# EAGLE design led (EAGLE 5.11)
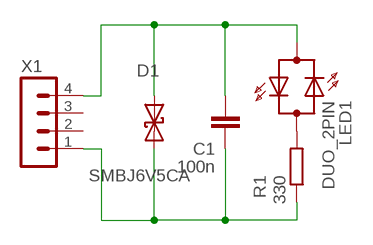
[diagram p0: schematic, sheet 1]

## Parts
C1  100n  C-SMD0805  [0805]
D1  SMBJ6V5CA  TRANZIL_BIDIRSMB_FW  [SMB_FW]
LED1  DUO_2PIN  [DUO_2PIN]
R1  330  R0805  [R0805]
X1  MA04-1  [MA04-1]

## Nets
N$1: C1.1 D1.A LED1.AK1(A) X1.4
N$2: C1.2 D1.C R1.1 X1.1
N$13: LED1.AK2(C) R1.2
Unconnected: X1.2 X1.3

## Library data of the parts
C1 = keramicke kondenzatory SMD:C-SMD: Kondenzátory keramické SMD 50 V
D1 = diode:TRANZIL_BIDIR
LED1 = led:DUO_2PIN
R1 = rezistory SMD:R0805: Rezistor SMD 0805
X1 = con-lstb:MA04-1: PIN HEADER

## Board
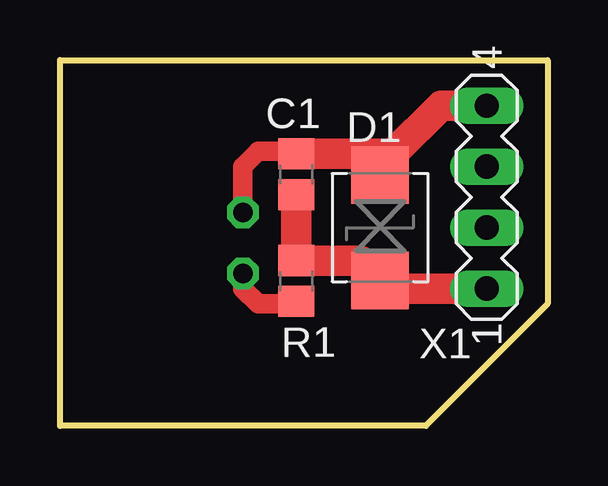
[diagram p1: board, top side]
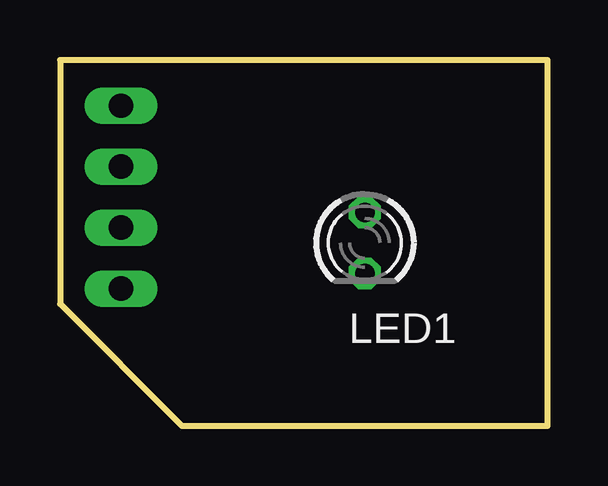
[diagram p2: board, bottom side, seen from below]

Size 20.32 x 15.24 mm. Coordinates in mm from the lower left corner, seen from the top.
Outline: 0,0 0,15.24 20.32,15.24 20.32,5.08 15.24,0 0,0
Copper layers (1*16): Top 0.035mm / dielectric 1.5mm / Bottom 0.035mm
Design rules "default": minimum track width 10mil, minimum drill 24mil, track to track 8mil, track to pad 8mil, pad to pad 8mil, via to via 8mil, smd to smd 8mil, copper to edge 40mil, drill to drill 8mil, minimum pad ring 10mil, minimum via ring 8mil, stop-mask expansion 4mil, vias tented up to drill 0mil, thermal gap 10mil

### Footprints (pad centres in the part's own frame; a part is rotated, then mirrored left to right if it is on the bottom)
0805 = smd 1.3 x 1.5: 1 -0.85,0; 2 0.85,0
SMB_FW = smd 2.4 x 2.4: A 2.2,0; C -2.2,0
DUO_2PIN = drill 0.813 octagon: AK1 -1.27,0; AK2 1.27,0
R0805 = smd 1.3 x 1.5: 1 -0.85,0; 2 0.85,0
MA04-1 = drill 1.016 long: 1 -3.81,0; 2 -1.27,0; 3 1.27,0; 4 3.81,0

### Placement (x,y rotation side)
C1  9.84,10.48 270 top
D1  13.34,8.26 90 top
LED1  7.62,7.62 270 bottom
R1  9.84,6.03 270 top
X1  17.78,9.53 90 top

### Tracks (layer width: path | path; a pad name or v marks a point on that pad's centre or on a via)
N$1
  Top 0.813: LED1.AK1 7.62,10.79 8.26,11.43 9.74,11.43 C1.1
  Top 1.27: C1.1 13.34,11.33 | 13.34,11.33 13.87,11.33 15.88,13.33 X1.4 | 13.34,11.33 D1.A
N$2
  Top 1.27: X1.1 13.34,5.71 D1.C 12.51,6.88 R1.1 C1.2
N$5  (via drill 0.5 pad 1.27)
  other vias: 7.62,8.89
N$6  (via drill 0.5 pad 1.27)
  other vias: 7.62,6.35
N$7  (via drill 0.5 pad 1.27)
  other vias: 17.78,13.33
N$8  (via drill 0.5 pad 1.27)
  other vias: 17.78,10.79
N$9  (via drill 0.5 pad 1.27)
  other vias: 17.78,8.26
N$10  (via drill 0.5 pad 1.27)
  other vias: 17.78,5.71
N$13
  Top 0.813: LED1.AK2 7.62,5.71 8.26,5.08 9.74,5.08 R1.2

### Text on the board
Measures: 20.32 | 10.16 | 15.24 | 15.24